# Altium schematic sheet ESP_Circuit.SchDoc
size A; SheetNumber: 1; SheetTotal: 1
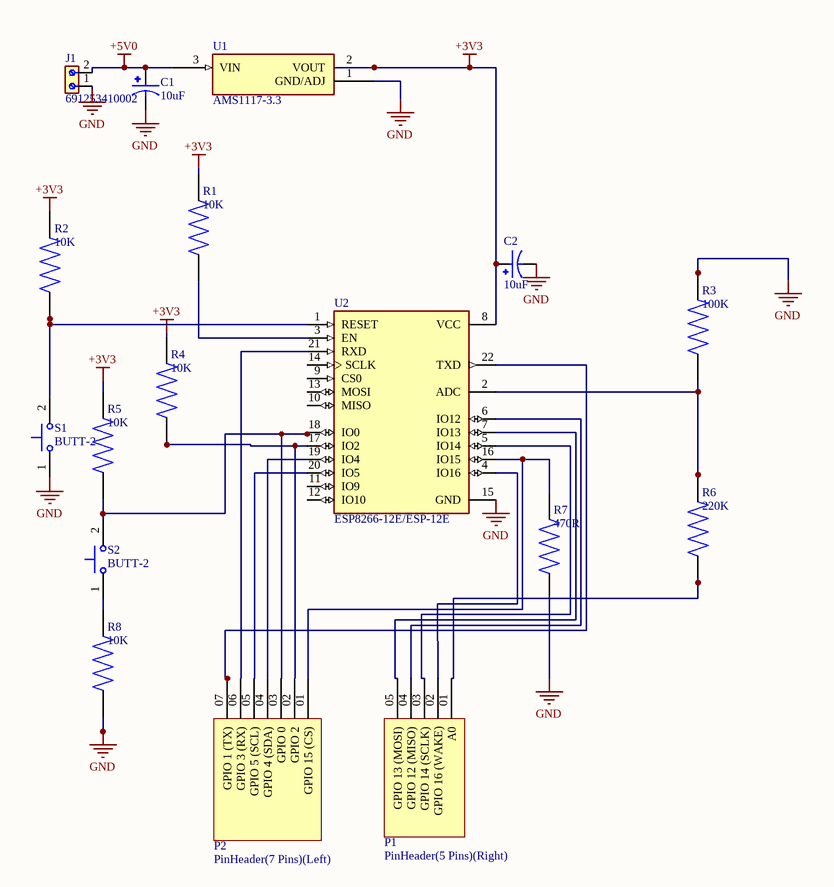
[diagram p0: ESP_Circuit.SchDoc]

## Parts
C1  10uF  [CAPPRD500W60D1000H2000]
C2  10uF  [CAPPRD500W60D1000H2000]
J1  691253410002  [691253410002]
P1  PinHeader(5 Pins)(Right)  [5 pins connector]
P2  PinHeader(7 Pins)(Left)  [7 pins connector]
R1  10K  [RESAD1100W55L680D260]
R2  10K  [RESAD1100W55L680D260]
R3  100K  [RESAD1100W55L680D260]
R4  10K  [RESAD1100W55L680D260]
R5  10K  [RESAD1100W55L680D260]
R6  220K  [RESAD1100W55L680D260]
R7  470R  [RESAD1100W55L680D260]
R8  10K  [RESAD1100W55L680D260]
S1  BUTT-2  [SW_BUTT-2]
S2  BUTT-2  [SW_BUTT-2]
U1  AMS1117-3.3  [SOT229P700X180-4N]
U2  ESP8266-12E/ESP-12E  [XCVR_ESP8266-12E/ESP-12E]

## Nets
+3V3: C2.P R1.2 R2.2 R4.2 R5.2 U1.2(VOUT) U2.8(VCC)
+5V0: C1.P J1.2 U1.3(VIN)
GND: C1.N C2.N J1.1 R3.2 R7.1 R8.1 S1.1 U1.1(GND/ADJ) U2.15(GND)
NetP1_01: P1.01(A0) R6.1
NetP1_02: P1.02(GPIO_16_(WAKE)) U2.4(IO16)
NetP1_03: P1.03(GPIO_14_(SCLK)) U2.5(IO14)
NetP1_04: P1.04(GPIO_12_(MISO)) U2.6(IO12)
NetP1_05: P1.05(GPIO_13_(MOSI)) U2.7(IO13)
NetP2_01: P2.01(GPIO_15_(CS)) R7.2 U2.16(IO15)
NetP2_02: P2.02(GPIO_2) R4.1 U2.17(IO2)
NetP2_03: P2.03(GPIO_0) R5.1 S2.2 U2.18(IO0)
NetP2_04: P2.04(GPIO_4_(SDA)) U2.19(IO4)
NetP2_05: P2.05(GPIO_5_(SCL)) U2.20(IO5)
NetP2_06: P2.06(GPIO_3_(RX)) U2.21(RXD)
NetP2_07: P2.07(GPIO_1_(TX)) U2.22(TXD)
NetR1_1: R1.1 U2.3(EN)
NetR2_1: R2.1 S1.2 U2.1(RESET)
NetR3_1: R3.1 R6.2 U2.2(ADC)
NetR8_2: R8.2 S2.1

Not connected (* = marked no-connect by the designer): U2 9(CS0) 10(MISO) 11(IO9) 12(IO10) 13(MOSI) 14(SCLK)

## Library data of the parts
C1 = EEUEB2V100B: Aluminum Electrolytic Capacitors - Radial Leaded 10uF 350volts AEC-Q200; MF: Panasonic; Value: 10μF; MP: EEU-EB2V100B; Price: None; Check_prices: https://www.snapeda.com/parts/EEU-EB2V100B/Panasonic/view-part/?ref=eda; SnapEDA_Link: https://www.snapeda.com/parts/EEU-EB2V100B/Panasonic/view-part/?ref=snap; Availability: In Stock; Package: RADIAL-2 Panasonic
C2 = EEUEB2V100B: Aluminum Electrolytic Capacitors - Radial Leaded 10uF 350volts AEC-Q200; MF: Panasonic; MP: EEU-EB2V100B; Price: None; Check_prices: https://www.snapeda.com/parts/EEU-EB2V100B/Panasonic/view-part/?ref=eda; SnapEDA_Link: https://www.snapeda.com/parts/EEU-EB2V100B/Panasonic/view-part/?ref=snap; Availability: In Stock; Value: *; Package: RADIAL-2 Panasonic
J1 = 691253410002: 7.62 MM TERMINAL BLOCK, HORIZONT; MF: WÃ¼rth Elektronik; Package: None; Price: None; Check_prices: https://www.snapeda.com/parts/691253410002/Wurth+Electronics+Inc./view-part/?ref=eda; Value: *; SnapEDA_Link: https://www.snapeda.com/parts/691253410002/Wurth+Electronics+Inc./view-part/?ref=snap; MP: 691253410002; Availability: In Stock; Purchase-URL: https://pricing.snapeda.com/search?q=691253410002&ref=eda
R1-R8 = MFR-25FBF52-3K16: RES 280K OHM 1/4W 1% AXIAL; Package: None; Price: None; MP: MFR-25FBF52-3K16; Availability: Unavailable
  R1 R2 R4 R5 R8: Value: 10K
  R3: Value: 100K
  R6: Value: 220K
  R7: Value: 470R
S1 S2 = BUTT-2: Tactile Switches MINI PUSH BUTTON SWITCH 2-PIN QTY. 4; MF: Gravitech; Purchase-URL: https://pricing.snapeda.com/search/part/BUTT-2/?ref=eda; Package: None; Value: *; Check_prices: https://www.snapeda.com/parts/BUTT-2/Gravitech/view-part/?ref=eda; SnapEDA_Link: https://www.snapeda.com/parts/BUTT-2/Gravitech/view-part/?ref=snap; Availability: In Stock; Price: None; MP: BUTT-2
U1 = AMS1117-3.3: Sot223/Pkg 1-Amp 3.3-Volt Low Drop Out Voltage Regulatator; MF: Advanced Monolithic Systems; Package: SOT-223 Seeed Technology; Value: *; Check_prices: https://www.snapeda.com/parts/AMS1117-3.3/Advanced+Monolithic+Systems/view-part/?ref=eda; Price: None; Availability: Not in stock; MP: AMS1117-3.3; SnapEDA_Link: https://www.snapeda.com/parts/AMS1117-3.3/Advanced+Monolithic+Systems/view-part/?ref=snap
U2 = ESP8266-12E/ESP-12E: This WiFi module has a 32-bit MCU micro and clock speeds supporting 80 MHz or 160 MHz. Supports the RTOS and integrated Wi-Fi MAC/BB/RF/PA/LNA, and has an on-board antenna.; MF: AI-Thinker; Value: *; SnapEDA_Link: https://www.snapeda.com/parts/ESP8266-12E/ESP-12E/AI-Thinker/view-part/?ref=snap; Availability: Not in stock; Price: None; Package: None; Check_prices: https://www.snapeda.com/parts/ESP8266-12E/ESP-12E/AI-Thinker/view-part/?ref=eda; MP: ESP8266-12E/ESP-12E